# EAGLE design Genesis_Model1_RGB_LED (EAGLE 7.5.0)
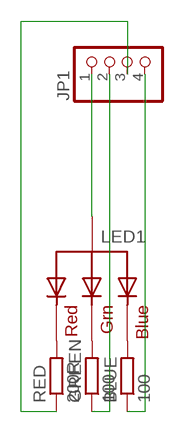
[diagram p0: schematic, sheet 1]

## Parts
BLUE  100  R-EU_R0805  [R0805]
GREEN  100  R-EU_R0805  [R0805]
JP1  PINHD-1X04_2.00  [1X04M]
LED1  RGBLED_CA-5MM  [LED5MMRGB]
RED  200R  R-EU_R0805  [R0805]

## Nets
N$10: LED1.1(RED) RED.2
N$11: GREEN.2 LED1.3(GREEN)
N$12: BLUE.2 LED1.4(BLUE)
N$13: JP1.3 RED.1
N$14: JP1.1 LED1.2(VCC)
N$15: GREEN.1 JP1.2
N$16: BLUE.1 JP1.4

## Library data of the parts
BLUE GREEN RED = resistor:R-EU_: RESISTOR, European symbol
JP1 = pinhead-2:PINHD-1X04: PIN HEADER
LED1 = adafruit:RGBLED_CA: RGB LED, common-anode 5MM Staggered pins 5mm Piranha package http://www.ladyada.net/library/pcb/eaglelibrary.html

## Board
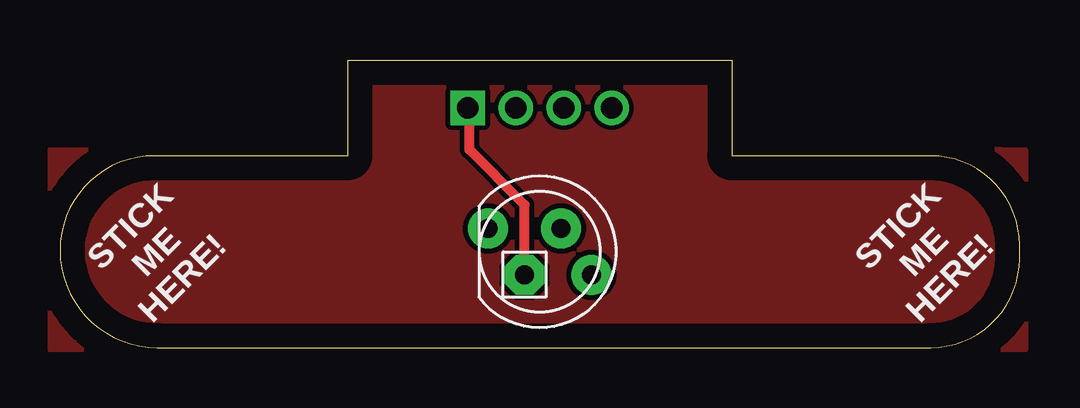
[diagram p1: board, top side]
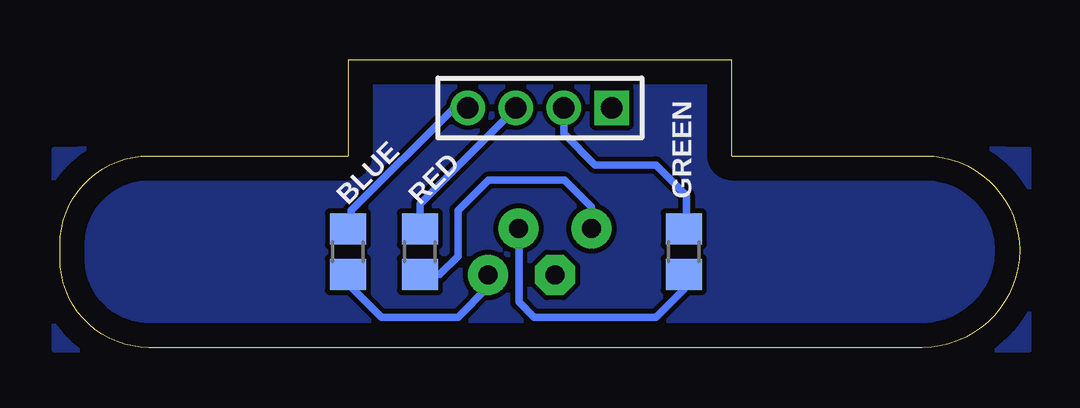
[diagram p2: board, bottom side, seen from below]

Size 40 x 12 mm. Coordinates in mm from the lower left corner, seen from the top.
Outline: 0,4.06 arc90 4.06,0 36.3,0 arc90 40,3.7 40,4.28 arc90 36.28,8 28,8 28,12 12,12 12,8 3.94,8 arc90 0,4.06
Copper layers (1*16): Top 0.035mm / dielectric 1.5mm / Bottom 0.035mm
Design rules "default": minimum track width 10mil, minimum drill 24mil, track to track 8mil, track to pad 8mil, pad to pad 8mil, via to via 8mil, smd to smd 8mil, copper to edge 40mil, drill to drill 8mil, minimum pad ring 10mil, minimum via ring 8mil, stop-mask expansion 4mil, vias tented up to drill 0mil, thermal gap 10mil

### Footprints (pad centres in the part's own frame; a part is rotated, then mirrored left to right if it is on the bottom)
R0805 = smd 1.3 x 1.5: 1 -0.95,0; 2 0.95,0
1X04M = drill 0.914 square: 1 -3,0 | drill 0.914: 2 -1,0; 3 1,0; 4 3,0
LED5MMRGB = drill 0.8 pad 1.676: 1 -2.159,0.968; 3 0.889,0.968; 4 2.159,-0.968 | drill 0.8 pad 1.676 octagon: 2 -0.635,-0.968

### Placement (x,y rotation side)
BLUE  28,4 270 bottom
GREEN  14,4 270 bottom
JP1  20,10 180 bottom
LED1  20,4 0 top
RED  25,4 270 bottom

### Tracks (layer width: path | path; a pad name or v marks a point on that pad's centre or on a via)
N$5
  pour Top: -0.39,8.24 11.5,8.24 11.5,12.5 28.5,12.24 28.5,8.5 40.23,8.24 40.23,-0.08 -0.39,-0.08
N$6
  pour Bottom: -0.39,8.24 11.5,8.5 11.5,12.24 28.5,12.24 28.5,8.5 40.23,8.24 40.23,-0.08 -0.39,-0.08
N$10
  Bottom 0.305: LED1.1 17.84,5.86 18.97,6.99 22.14,6.99 23.41,5.71 23.41,3.81 24.18,3.05 RED.2
N$11
  Bottom 0.305: GREEN.2 14,2.43 15.16,1.27 20.24,1.27 20.88,1.91 20.88,4.95 LED1.3
N$12
  Bottom 0.305: LED1.4 22.16,2.53 23.41,1.27 26.59,1.27 27.86,2.54 27.86,2.91 BLUE.2
N$13
  Bottom 0.305: RED.1 25,6 JP1.3
N$14
  Top 0.406: LED1.2 19.36,5.96 17.07,8.26 17.07,9.94 JP1.1
N$15
  Bottom 0.305: JP1.2 19,8.92 17.7,7.62 15.16,7.62 13.89,6.35 13.89,5.06 GREEN.1
N$16
  Bottom 0.305: JP1.4 23.57,10 27.86,5.71 27.86,5.09 BLUE.1

### Text on the board
tPlace: STICK / ME / HERE! | STICK / ME / HERE!